# EAGLE design master (EAGLE 6.4)

## Sheet 1 of 2
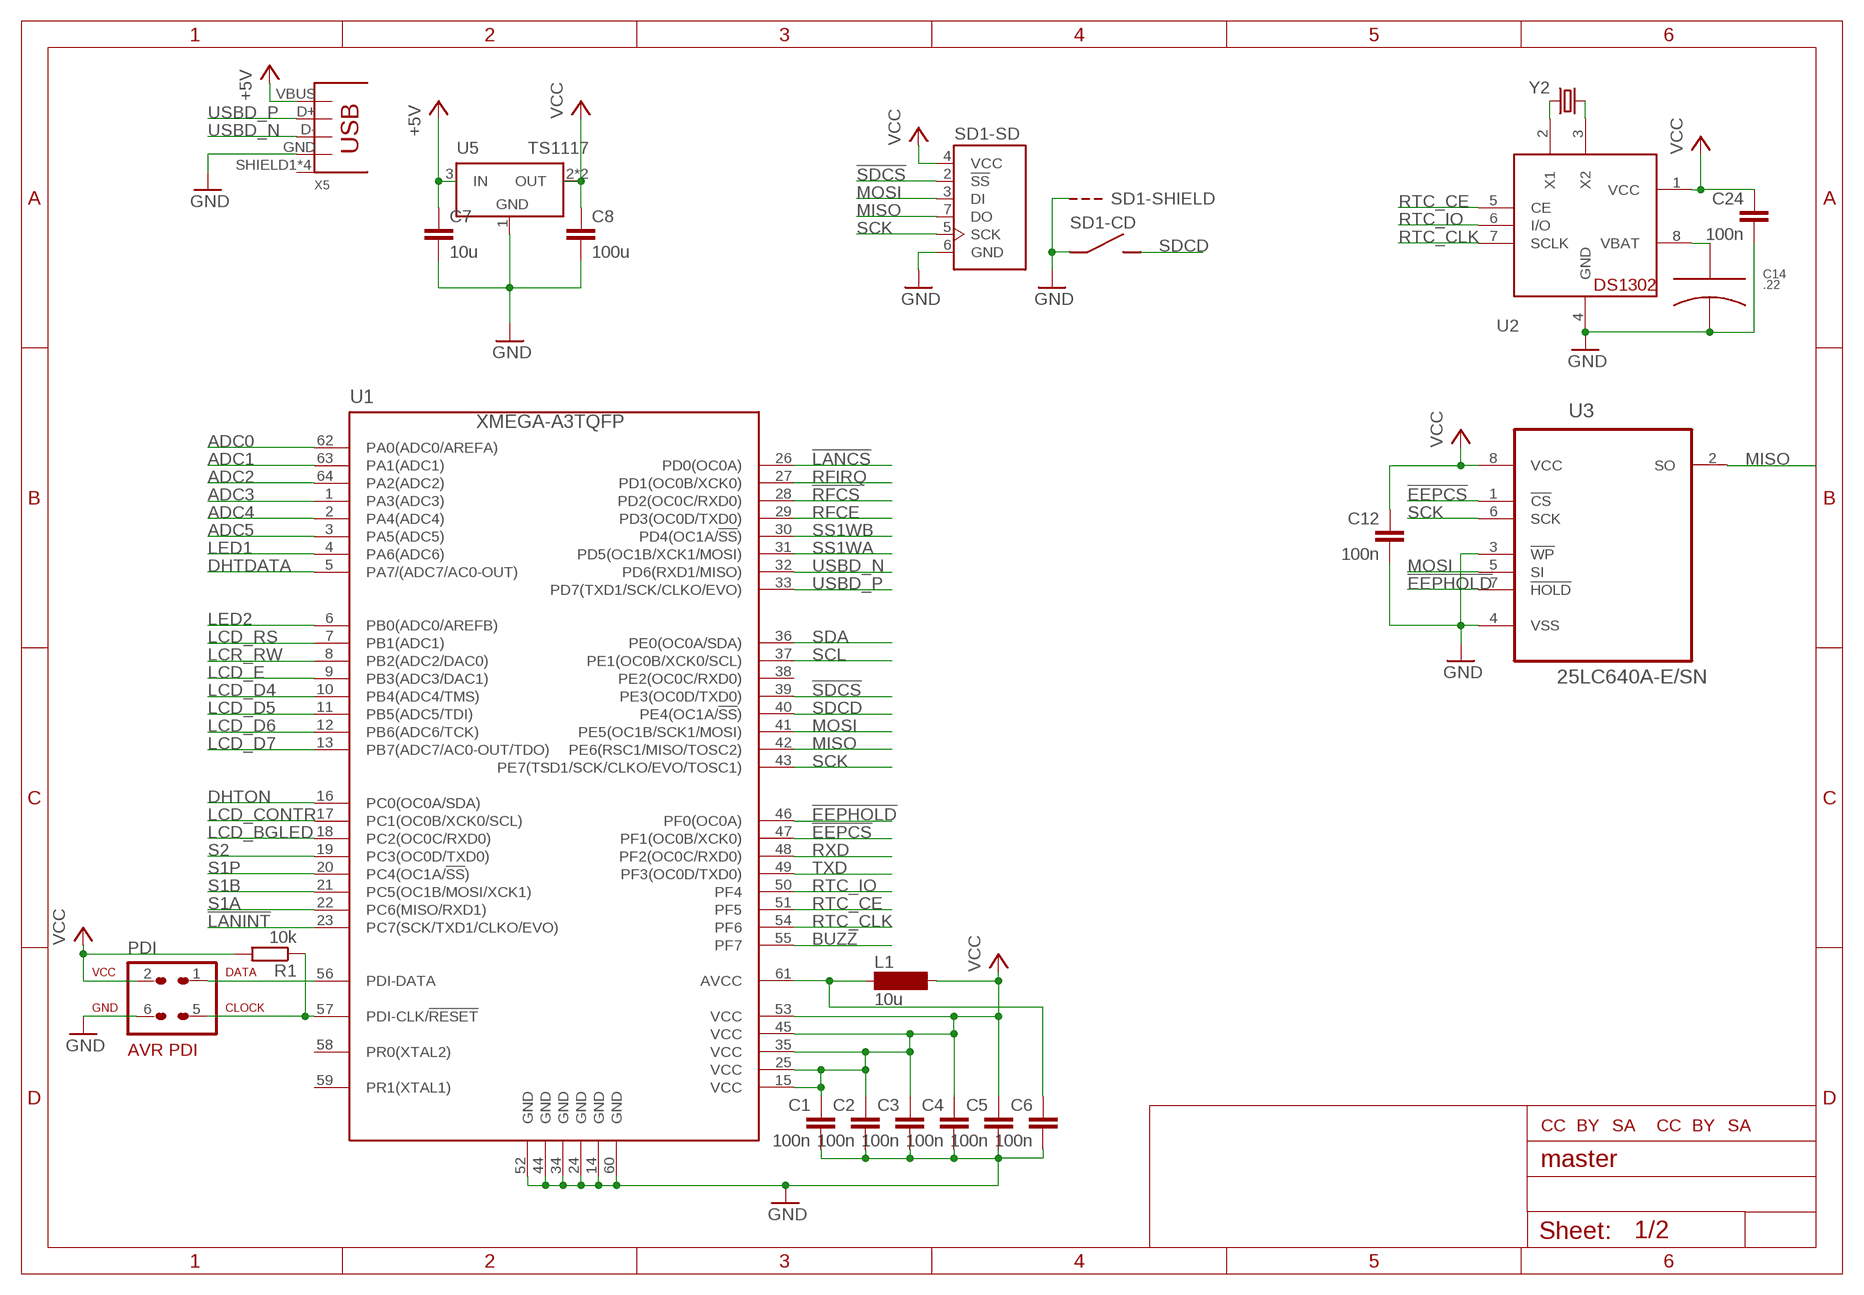
[diagram p0: schematic, sheet 1]

### Parts
C1  100n  C-EUC0603  [C0603]
C2  100n  C-EUC0603  [C0603]
C3  100n  C-EUC0603  [C0603]
C4  100n  C-EUC0603  [C0603]
C5  100n  C-EUC0603  [C0603]
C6  100n  C-EUC0603  [C0603]
C7  10u  C-EUC1206  [C1206]
C8  100u  C-EUC1210  [C1210]
C12  100n  C-EUC0603  [C0603]
C14  .22  SUPERCAP  [SUPERCAP]
C24  100n  C-EUC0603  [C0603]
L1  10u  SM-NE29  [SM-NE29]
PDI  AVR-PDIVERT  [AVR-ISP-6]
R1  10k  R-EU_R0603  [R0603]
SD1  MICROSD_SW  [MICROSD_SMD_EXTPIN]
U1  XMEGA-A3TQFP  [TQFP64]
U2  DS1302SOIC  [SOIC8_208MIL]
U3  25LC640A-E/SN  [SOIC127P600X175-8N]
U5  TS1117  [SOT223]
U$1  CC-TPLACE-HALF  [CC_TPLACE_HS]
U$2  BY-TPLACE-HS  [BY_TPLACE_HS]
U$7  SA-TPLACE-HALF  [SA_TPLACE_HS]
U$8  CC-TOP-HALF  [CC_TOP_HS]
U$9  BY-TOP-HALF  [BY_TOP_HS]
U$10  SA-TOP-HALF  [SA_TOP_HS]
X5  USB-MB-S  [USB-MB-S]
Y2  CRYSTALTC26H  [TC26H]

### Nets
!EEPCS: U1.47(PF1(OC0B/XCK0)) U3.1(!CS)
!EEPHOLD: U1.46(PF0(OC0A)) U3.7(!HOLD)
!LANCS: U1.26(PD0(OC0A)) ; also sheet 2
!LANINT: U1.23(PC7(SCK/TXD1/CLKO/EVO)) ; also sheet 2
!RFCS: U1.28(PD2(OC0C/RXD0)) ; also sheet 2
!SDCS: SD1.2(-SD:!SS) U1.39(PE3(OC0D/TXD0))
+5V [pwr]: C7.1 U5.3(IN) X5.VBUS ; also sheet 2
ADC0: U1.62(PA0(ADC0/AREFA)) ; also sheet 2
ADC1: U1.63(PA1(ADC1)) ; also sheet 2
ADC2: U1.64(PA2(ADC2)) ; also sheet 2
ADC3: U1.1(PA3(ADC3)) ; also sheet 2
ADC4: U1.2(PA4(ADC4)) ; also sheet 2
ADC5: U1.3(PA5(ADC5)) ; also sheet 2
BUZZ: U1.55(PF7) ; also sheet 2
DHTDATA: U1.5(PA7/(ADC7/AC0-OUT)) ; also sheet 2
DHTON: U1.16(PC0(OC0A/SDA)) ; also sheet 2
GND [pwr]: C1.2 C2.2 C3.2 C4.2 C5.2 C6.2 C7.2 C8.2 C12.2 C14.P$2 C24.2 PDI.6 SD1.6(-SD:GND) SD1.CD1(-CD:CD1) SD1.NC1(-SHIELD:SHIELD) SD1.NC2(-SHIELD:SHIELD) U1.14(GND) U1.24(GND) U1.34(GND) U1.44(GND) U1.52(GND) U1.60(GND) U2.4(GND) U3.3(!WP) U3.4(VSS) U5.1(GND) X5.GND ; also sheet 2
LCD_BGLED: U1.18(PC2(OC0C/RXD0)) ; also sheet 2
LCD_CONTR: U1.17(PC1(OC0B/XCK0/SCL)) ; also sheet 2
LCD_D4: U1.10(PB4(ADC4/TMS)) ; also sheet 2
LCD_D5: U1.11(PB5(ADC5/TDI)) ; also sheet 2
LCD_D6: U1.12(PB6(ADC6/TCK)) ; also sheet 2
LCD_D7: U1.13(PB7(ADC7/AC0-OUT/TDO)) ; also sheet 2
LCD_E: U1.9(PB3(ADC3/DAC1)) ; also sheet 2
LCD_RS: U1.7(PB1(ADC1)) ; also sheet 2
LCR_RW: U1.8(PB2(ADC2/DAC0)) ; also sheet 2
LED1: U1.4(PA6(ADC6)) ; also sheet 2
LED2: U1.6(PB0(ADC0/AREFB)) ; also sheet 2
MISO: SD1.7(-SD:DO) U1.42(PE6(RSC1/MISO/TOSC2)) U3.2(SO) ; also sheet 2
MOSI: SD1.3(-SD:DI) U1.41(PE5(OC1B/SCK1/MOSI)) U3.5(SI) ; also sheet 2
N$1: U2.2(X1) Y2.2
N$3: U2.3(X2) Y2.1
N$6: C14.P$1 U2.8(VBAT)
N$10: PDI.1 U1.56(PDI-DATA)
N$11: PDI.5 R1.1 U1.57(PDI-CLK/!RESET)
N$15: C6.1 L1.1 U1.61(AVCC)
RFCE: U1.29(PD3(OC0D/TXD0)) ; also sheet 2
RFIRQ: U1.27(PD1(OC0B/XCK0)) ; also sheet 2
RTC_CE: U1.51(PF5) U2.5(CE)
RTC_CLK: U1.54(PF6) U2.7(SCLK)
RTC_IO: U1.50(PF4) U2.6(I/O)
RXD: U1.48(PF2(OC0C/RXD0)) ; also sheet 2
S1A: U1.22(PC6(MISO/RXD1)) ; also sheet 2
S1B: U1.21(PC5(OC1B/MOSI/XCK1)) ; also sheet 2
S1P: U1.20(PC4(OC1A/!SS!)) ; also sheet 2
S2: U1.19(PC3(OC0D/TXD0)) ; also sheet 2
SCK: SD1.5(-SD:SCK) U1.43(PE7(TSD1/SCK/CLKO/EVO/TOSC1)) U3.6(SCK) ; also sheet 2
SCL: U1.37(PE1(OC0B/XCK0/SCL)) ; also sheet 2
SDA: U1.36(PE0(OC0A/SDA)) ; also sheet 2
SDCD: SD1.CD2(-CD:CD2) U1.40(PE4(OC1A/!SS!))
SS1WA: U1.31(PD5(OC1B/XCK1/MOSI)) ; also sheet 2
SS1WB: U1.30(PD4(OC1A/!SS!)) ; also sheet 2
TXD: U1.49(PF3(OC0D/TXD0)) ; also sheet 2
USBD_N: U1.32(PD6(RXD1/MISO)) X5.D-
USBD_P: U1.33(PD7(TXD1/SCK/CLKO/EVO)) X5.D+
VCC [pwr]: C1.1 C2.1 C3.1 C4.1 C5.1 C8.1 C12.1 C24.1 L1.2 PDI.2 R1.2 SD1.4(-SD:VCC) U1.15(VCC) U1.25(VCC) U1.35(VCC) U1.45(VCC) U1.53(VCC) U2.1(VCC) U3.8(VCC) U5.2(OUT) U5.4(OUT) ; also sheet 2
Unconnected: U1.38(PE2(OC0C/RXD0)) U1.58(PR0(XTAL2)) U1.59(PR1(XTAL1)) X5.SHIELD1(SHIELD) X5.SHIELD2(SHIELD) X5.SHIELD3(SHIELD) X5.SHIELD4(SHIELD)

## Sheet 2 of 2
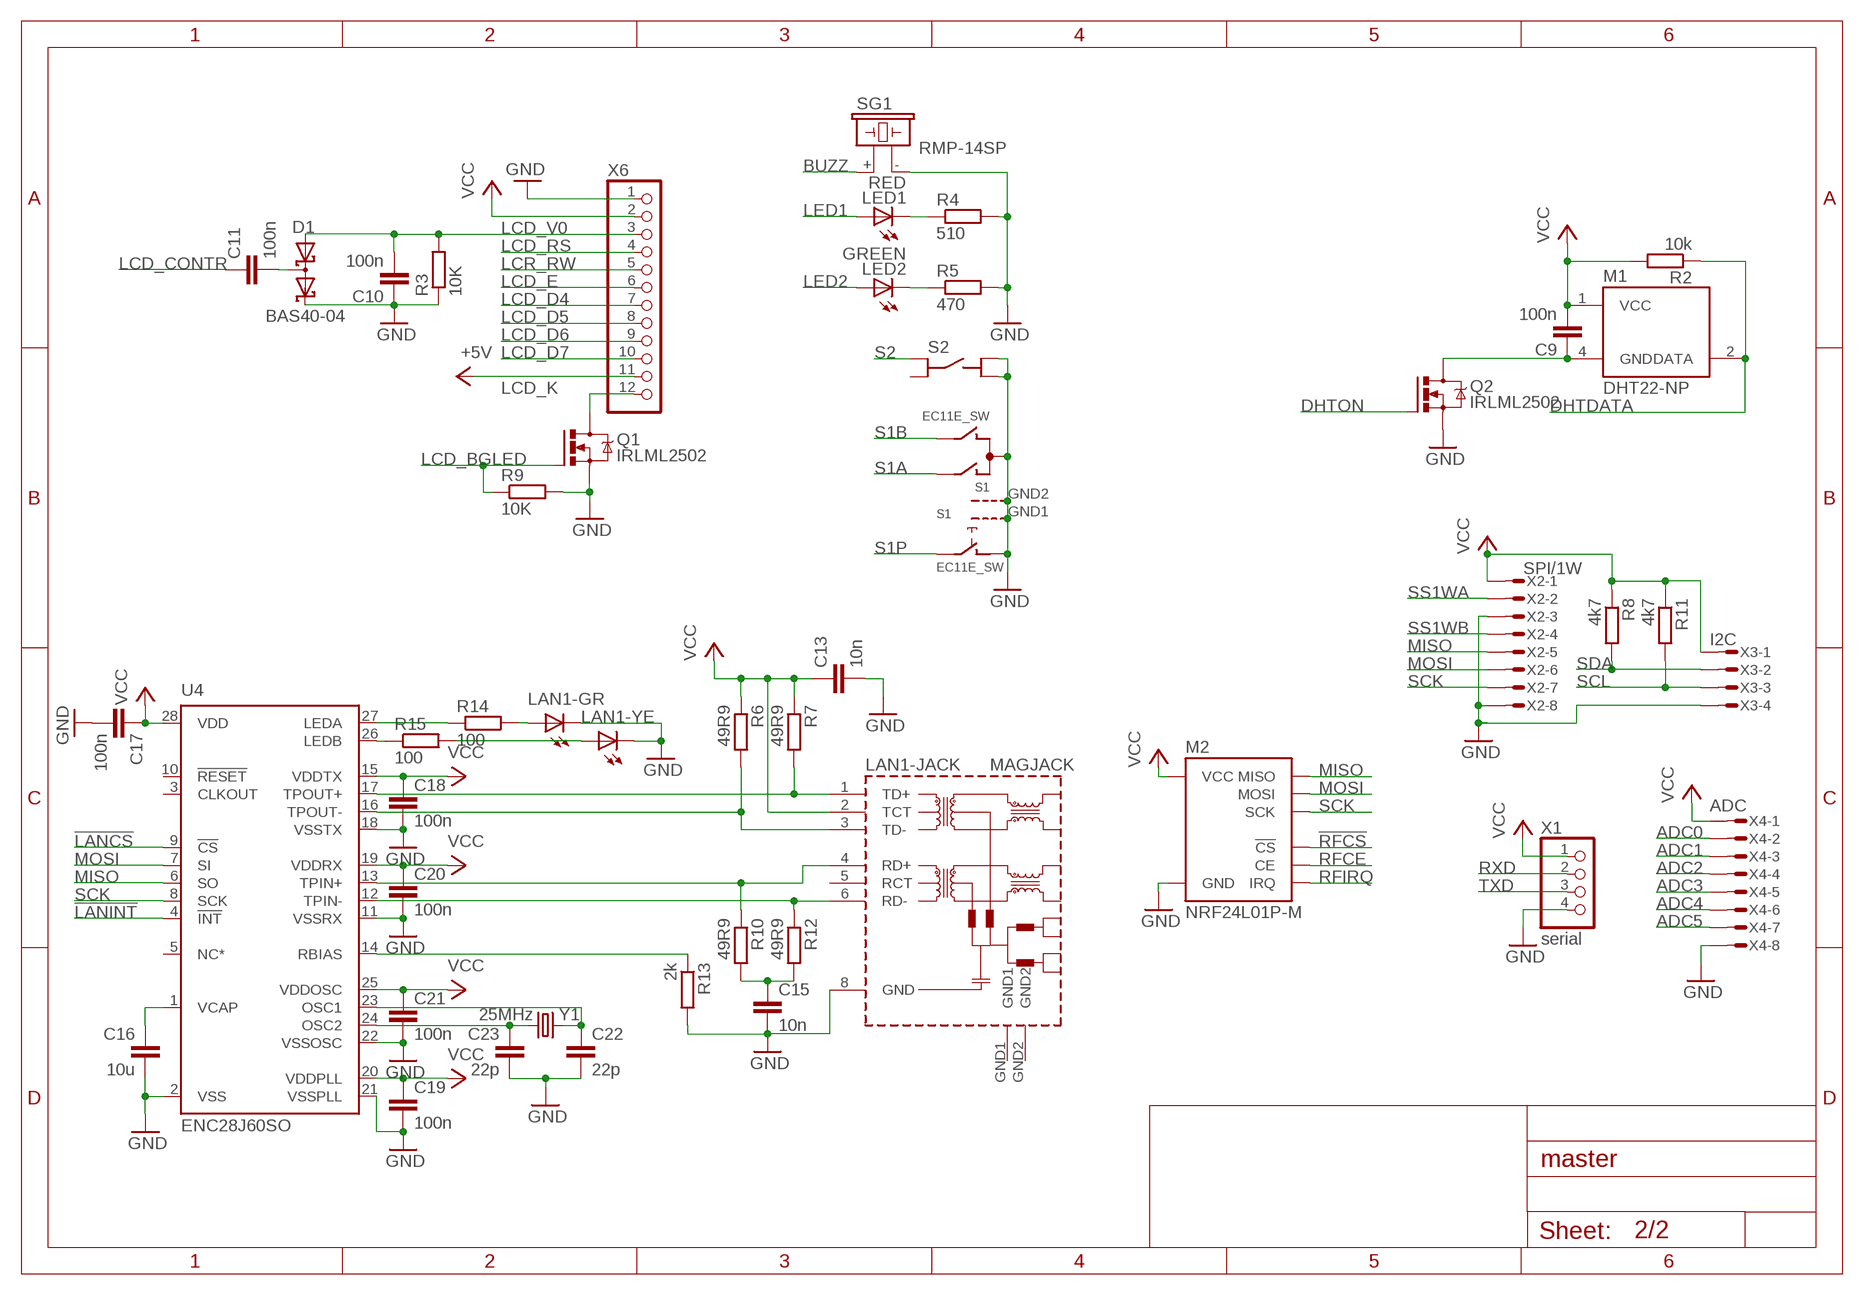
[diagram p1: schematic, sheet 2]

### Parts
C9  100n  C-EUC0603  [C0603]
C10  100n  C-EUC0603  [C0603]
C11  100n  C-EUC0603  [C0603]
C13  10n  C-EUC0603  [C0603]
C15  10n  C-EUC0603  [C0603]
C16  10u  C-EUC0603  [C0603]
C17  100n  C-EUC0603  [C0603]
C18  100n  C-EUC0603  [C0603]
C19  100n  C-EUC0603  [C0603]
C20  100n  C-EUC0603  [C0603]
C21  100n  C-EUC0603  [C0603]
C22  22p  C-EUC0603  [C0603]
C23  22p  C-EUC0603  [C0603]
D1  BAS40-04  [SOT23]
LAN1  MAGJACK  [MAGJACK]
LED1  RED  LED5MM  [LED5MM]
LED2  GREEN  LED5MM  [LED5MM]
M1  DHT22-NP  [DHT22-NOPRINT]
M2  NRF24L01P-M  [NRF24L01P-A]
Q1  IRLML2502  [MICRO3]
Q2  IRLML2502  [MICRO3]
R2  10k  R-EU_R0603  [R0603]
R3  10K  R-EU_R0603  [R0603]
R4  510  R-EU_R0603  [R0603]
R5  470  R-EU_R0603  [R0603]
R6  49R9  R-EU_R0603  [R0603]
R7  49R9  R-EU_R0603  [R0603]
R8  4k7  R-EU_R0603  [R0603]
R9  10K  R-EU_R0603  [R0603]
R10  49R9  R-EU_R0603  [R0603]
R11  4k7  R-EU_R0603  [R0603]
R12  49R9  R-EU_R0603  [R0603]
R13  2k  R-EU_R0603  [R0603]
R14  100  R-EU_R0603  [R0603]
R15  100  R-EU_R0603  [R0603]
S1  EC11E_SW  [ALPS_EC11E_SW]
S2  MEC-SWITCHSMT  [MEC-SMT]
SG1  RMP-14SP  F/CM12P  [F/CM12P]
U4  ENC28J60SO  [SO28W]
X1  serial  PINHD-1X4_2.54  [1X04]
X2  SPI/1W  MICROMATCH-8  [MICROMATCH-8]
X3  I2C  MICROMATCH-4  [MICROMATCH-4]
X4  ADC  MICROMATCH-8  [MICROMATCH-8]
X6  PINHD-1X12_2.54-R  [1X12R]
Y1  25MHz  CRYSTALHC49S  [HC49/S]

### Nets
!LANCS: U4.9(!CS) ; also sheet 1
!LANINT: U4.4(!INT) ; also sheet 1
!RFCS: M2.CSN(!CS) ; also sheet 1
+5V [pwr]: X6.11 ; also sheet 1
ADC0: X4.2 ; also sheet 1
ADC1: X4.3 ; also sheet 1
ADC2: X4.4 ; also sheet 1
ADC3: X4.5 ; also sheet 1
ADC4: X4.6 ; also sheet 1
ADC5: X4.7 ; also sheet 1
BUZZ: SG1.+ ; also sheet 1
DHTDATA: M1.2(DATA) R2.1 ; also sheet 1
DHTON: Q2.1(G) ; also sheet 1
GND [pwr]: C10.1 C13.2 C15.2 C16.2 C17.2 C18.2 C19.2 C20.2 C21.2 C22.2 C23.2 D1.2(C2) LAN1.8(-JACK:GND) LAN1.LED1.2(-YE:C) LAN1.LED2.2(-GR:C) M2.GND_A(GND) M2.GND_B(GND) Q1.2(S) Q2.2(S) R3.1 R4.2 R5.2 R9.2 R13.2 S1.C S1.D S1.GND1(G) S1.GND2(G) S2.3(B1) S2.4(B2) SG1.- U4.2(VSS) U4.11(VSSRX) U4.18(VSSTX) U4.21(VSSPLL) U4.22(VSSOSC) X1.4 X2.3 X2.8 X3.4 X4.8 X6.1 ; also sheet 1
LCD_BGLED: Q1.1(G) R9.1 ; also sheet 1
LCD_CONTR: C11.1 ; also sheet 1
LCD_D4: X6.7 ; also sheet 1
LCD_D5: X6.8 ; also sheet 1
LCD_D6: X6.9 ; also sheet 1
LCD_D7: X6.10 ; also sheet 1
LCD_E: X6.6 ; also sheet 1
LCD_K: Q1.3(D) X6.12
LCD_RS: X6.4 ; also sheet 1
LCD_V0: C10.2 D1.1(A1) R3.2 X6.3
LCR_RW: X6.5 ; also sheet 1
LED1: LED1.A ; also sheet 1
LED2: LED2.A ; also sheet 1
MISO: M2.MISO U4.6(SO) X2.5 ; also sheet 1
MOSI: M2.MOSI U4.7(SI) X2.6 ; also sheet 1
N$2: LED1.K(C) R4.1
N$4: C11.2 D1.3(C1A2)
N$5: LED2.K(C) R5.1
N$7: LAN1.4(-JACK:RD+) R10.1 U4.13(TPIN+)
N$8 [pwr]: C9.1 M1.4(GND) Q2.3(D)
N$12: LAN1.6(-JACK:RD-) R12.1 U4.12(TPIN-)
N$13: LAN1.3(-JACK:TD-) R6.2 U4.16(TPOUT-)
N$14: LAN1.1(-JACK:TD+) R7.2 U4.17(TPOUT+)
N$16: C15.1 R10.2 R12.2
N$17: R13.1 U4.14(RBIAS)
N$18: C23.1 U4.24(OSC2) Y1.1
N$19: C22.1 U4.23(OSC1) Y1.2
N$20: C16.1 U4.1(VCAP)
N$21: R14.1 U4.27(LEDA)
N$22: R15.1 U4.26(LEDB)
N$23: LAN1.LED2.1(-GR:A) R14.2
N$24: LAN1.LED1.1(-YE:A) R15.2
RFCE: M2.CE ; also sheet 1
RFIRQ: M2.IRQ ; also sheet 1
RXD: X1.2 ; also sheet 1
S1A: S1.A ; also sheet 1
S1B: S1.B ; also sheet 1
S1P: S1.E ; also sheet 1
S2: S2.1(A1) ; also sheet 1
SCK: M2.SCK U4.8(SCK) X2.7 ; also sheet 1
SCL: R11.2 X3.3 ; also sheet 1
SDA: R8.2 X3.2 ; also sheet 1
SS1WA: X2.2 ; also sheet 1
SS1WB: X2.4 ; also sheet 1
TXD: X1.3 ; also sheet 1
VCC [pwr]: C9.2 C13.1 C17.1 C18.1 C19.1 C20.1 C21.1 LAN1.2(-JACK:TCT) M1.1(VCC) M2.VCC_A(VCC) M2.VCC_B(VCC) R2.2 R6.1 R7.1 R8.1 R11.1 U4.15(VDDTX) U4.19(VDDRX) U4.20(VDDPLL) U4.25(VDDOSC) U4.28(VDD) X1.1 X2.1 X3.1 X4.1 X6.2 ; also sheet 1
Unconnected: LAN1.5(-JACK:RCT) LAN1.GND1(-JACK:GND1) LAN1.GND2(-JACK:GND2) S2.2(A2) U4.3(CLKOUT) U4.5(NC*) U4.10(!RESET)

## Library data of the parts
C1-C6 C9-C13 C15-C24 = rcl:C-EU: CAPACITOR, European symbol
C7 = rcl:C-EU: CAPACITOR, European symbol; _REICHELT_: X7R-G1206 10/16
C8 = rcl:C-EU: CAPACITOR, European symbol; _REICHELT_: X5R-G1210 100
C14 = carrilib:SUPERCAP: SuperCap, 5.5V .33F Manufacturer: Cornell Dubilier Part Number: EDLSD334V5R5C
D1 = diode:BAS40-04: Silicon Schottky Diodes General-purpose diode for high-speed switching
L1 = inductor-neosid:SM-NE29: INDUCTOR SMD chip inductor; OC_FARNELL: unknown; OC_NEWARK: unknown
LAN1 = magjack:MAGJACK: MagJack with slightly smaller than recommended, but better fitting pad-drills. SI-60024 SI-40138 SI-40139 SI-40140 SI-60062-F
LED1 = led:LED: LED OSRAM: - CHIPLED LG R971, LG N971, LY N971, LG Q971, LY Q971, LO R971, LY R971 LH N974, LH R974 LS Q976, LO Q976, LY Q976 LO Q996 - Hyper CHIPLED LW Q18S LB Q993, LB Q99A, LB R99A - SideLED LS A670, LO A670, LY A670, LG A670, LP A670 LB A673, LV A673, LT A673, LW A673 LH A674 LY A675 LS A676, LA A676, LO A676, LY A676, LW A676 LS A679, LY A679, LG A679 - Hyper Micro SIDELED® LS Y876, LA Y876, LO Y876, LY Y876 LT Y87S - SmartLED LW L88C, LW L88S LB L89C, LB L89S, LG L890 LS L89K, LO L89K, LY L89K LS L896, LA L896, LO L896, LY L896 - TOPLED LS T670, LO T670, LY T670, LG T670, LP T670 LSG T670, LSP T670, LSY T670, LOP T670, LYG T670 LG T671, LOG T671, LSG T671 LB T673, LV T673, LT T673, LW T673 LH T674 LS T676, LA T676, LO T676, LY T676, LB T676, LH T676, LSB T676, LW T676 LB T67C, LV T67C, LT T67C, LS T67K, LO T67K, LY T67K, LW E67C LS E67B, LA E67B, LO E67B, LY E67B, LB E67C, LV E67C, LT E67C LW T67C LS T679, LY T679, LG T679 LS T770, LO T770, LY T770, LG T770, LP T770 LB T773, LV T773, LT T773, LW T773 LH T774 LS E675, LA E675, LY E675, LS T675 LS T776, LA T776, LO T776, LY T776, LB T776 LHGB T686 LT T68C, LB T68C - Hyper Mini TOPLED® LB M676 - Mini TOPLED Santana® LG M470 LS M47K, LO M47K, LY M47K Source: http://www.osram.convergy.de LUXEON: - LUMILED® LXK2-PW12-R00, LXK2-PW12-S00, LXK2-PW14-U00, LXK2-PW14-V00 LXK2-PM12-R00, LXK2-PM12-S00, LXK2-PM14-U00 LXK2-PE12-Q00, LXK2-PE12-R00, LXK2-PE12-S00, LXK2-PE14-T00, LXK2-PE14-U00 LXK2-PB12-K00, LXK2-PB12-L00, LXK2-PB12-M00, LXK2-PB14-N00, LXK2-PB14-P00, LXK2-PB14-Q00 LXK2-PR12-L00, LXK2-PR12-M00, LXK2-PR14-Q00, LXK2-PR14-R00 LXK2-PD12-Q00, LXK2-PD12-R00, LXK2-PD12-S00 LXK2-PH12-R00, LXK2-PH12-S00 LXK2-PL12-P00, LXK2-PL12-Q00, LXK2-PL12-R00 Source: www.luxeon.com KINGBRIGHT: KA-3528ASYC Source: www.kingbright.com; I: 2mA; U_F: 2V
LED2 = led:LED: LED OSRAM: - CHIPLED LG R971, LG N971, LY N971, LG Q971, LY Q971, LO R971, LY R971 LH N974, LH R974 LS Q976, LO Q976, LY Q976 LO Q996 - Hyper CHIPLED LW Q18S LB Q993, LB Q99A, LB R99A - SideLED LS A670, LO A670, LY A670, LG A670, LP A670 LB A673, LV A673, LT A673, LW A673 LH A674 LY A675 LS A676, LA A676, LO A676, LY A676, LW A676 LS A679, LY A679, LG A679 - Hyper Micro SIDELED® LS Y876, LA Y876, LO Y876, LY Y876 LT Y87S - SmartLED LW L88C, LW L88S LB L89C, LB L89S, LG L890 LS L89K, LO L89K, LY L89K LS L896, LA L896, LO L896, LY L896 - TOPLED LS T670, LO T670, LY T670, LG T670, LP T670 LSG T670, LSP T670, LSY T670, LOP T670, LYG T670 LG T671, LOG T671, LSG T671 LB T673, LV T673, LT T673, LW T673 LH T674 LS T676, LA T676, LO T676, LY T676, LB T676, LH T676, LSB T676, LW T676 LB T67C, LV T67C, LT T67C, LS T67K, LO T67K, LY T67K, LW E67C LS E67B, LA E67B, LO E67B, LY E67B, LB E67C, LV E67C, LT E67C LW T67C LS T679, LY T679, LG T679 LS T770, LO T770, LY T770, LG T770, LP T770 LB T773, LV T773, LT T773, LW T773 LH T774 LS E675, LA E675, LY E675, LS T675 LS T776, LA T776, LO T776, LY T776, LB T776 LHGB T686 LT T68C, LB T68C - Hyper Mini TOPLED® LB M676 - Mini TOPLED Santana® LG M470 LS M47K, LO M47K, LY M47K Source: http://www.osram.convergy.de LUXEON: - LUMILED® LXK2-PW12-R00, LXK2-PW12-S00, LXK2-PW14-U00, LXK2-PW14-V00 LXK2-PM12-R00, LXK2-PM12-S00, LXK2-PM14-U00 LXK2-PE12-Q00, LXK2-PE12-R00, LXK2-PE12-S00, LXK2-PE14-T00, LXK2-PE14-U00 LXK2-PB12-K00, LXK2-PB12-L00, LXK2-PB12-M00, LXK2-PB14-N00, LXK2-PB14-P00, LXK2-PB14-Q00 LXK2-PR12-L00, LXK2-PR12-M00, LXK2-PR14-Q00, LXK2-PR14-R00 LXK2-PD12-Q00, LXK2-PD12-R00, LXK2-PD12-S00 LXK2-PH12-R00, LXK2-PH12-S00 LXK2-PL12-P00, LXK2-PL12-Q00, LXK2-PL12-R00 Source: www.luxeon.com KINGBRIGHT: KA-3528ASYC Source: www.kingbright.com; I: 2.2mA; U_F: 2V2
M1 = modules:DHT22
M2 = modules:NRF24L01P-M
PDI = avr-7:AVR-PDI: AVR PDI programming interface connector
Q1 Q2 = mosfet:IRLML2502: HEXFET N-Channel Power MOSFET http://www.irf.com/product-info/datasheets/data/irlml2502.pdf
R1-R15 = rcl:R-EU_: RESISTOR, European symbol
S1 = switch-alps:EC11E_SW: ALPS rotary Encoder EC12E series with switch
S2 = jt-switches:MEC-SWITCH: MEC switch
SD1 = sd:MICROSD_SW
SG1 = buzzer:F/CM12P: BUZZER Source: Buerklin; OC_FARNELL: unknown; OC_NEWARK: unknown
U1 = avr-7:XMEGA-A3: Atmel XMega A3 series processor
U2 = adafruit:DS1302: DS1302 - Real time clock with supercap trickle charger
U3 = microchip:25LC640A-E/SN: IC EEPROM 64KBIT 10MHZ,SOIC-8; MPN: 25LC640A-E/SN; OC_FARNELL: 2098000; OC_NEWARK: 27M1308; PACKAGE: SOIC-8; SUPPLIER: Microchip
U4 = microchip:ENC28J60: Stand-Alone Ethernet Controller with SPI Interface Source: http://ww1.microchip.com/downloads/en/DeviceDoc/39662c.pdf
U5 = TS1117:TS1117
U$1 U$8 = creative-commons:CC: creatice commons - CC
U$2 U$9 = creative-commons:BY: creative commons Attribution - BY
U$7 U$10 = creative-commons:SA: creative commons ShareAlike - SA
X1 = pinhead-mod:PINHD-1X4: PIN HEADER
X2 X4 = con-amp-micromatch:MICROMATCH-8: MicroMaTch 8 7-215464-8 / 0-215464-8 Drawing Number C-215464 DDEController.pdf
X3 = con-amp-micromatch:MICROMATCH-4: MicroMaTch 4 7-215464-4 / 0-215464-4 Drawing Number C-215464 DDEController.pdf
X5 = con-usb:USB: USB Connectors
X6 = pinhead-mod:PINHD-1X12: PIN HEADER
Y1 = crystal:CRYSTAL: CRYSTAL; OC_FARNELL: 1667008; OC_NEWARK: unknown
Y2 = crystal:CRYSTAL: CRYSTAL; OC_FARNELL: unknown; OC_NEWARK: unknown

## Net classes
1 pwr: width 0.254 mm

## Board
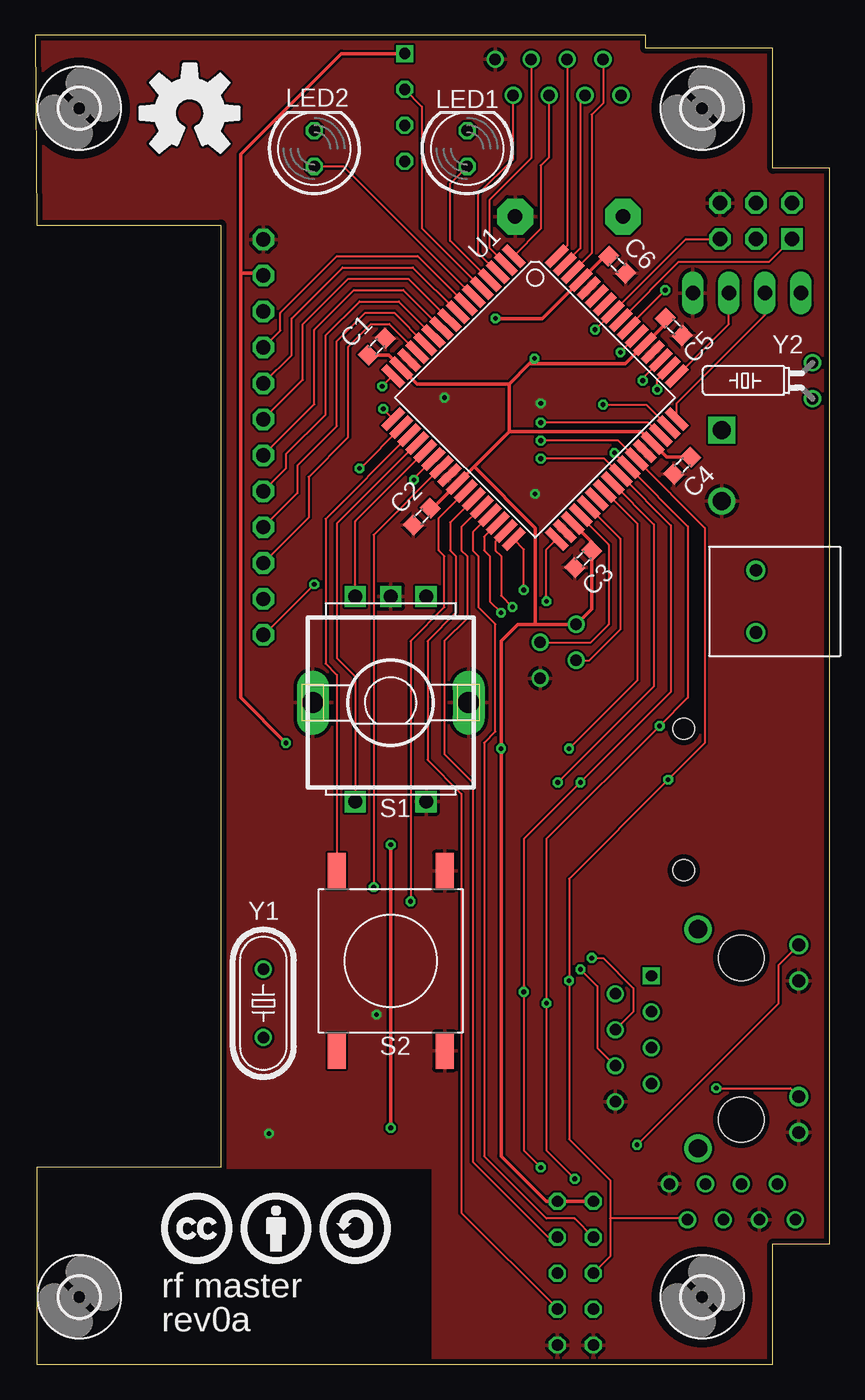
[diagram p2: board, top side]
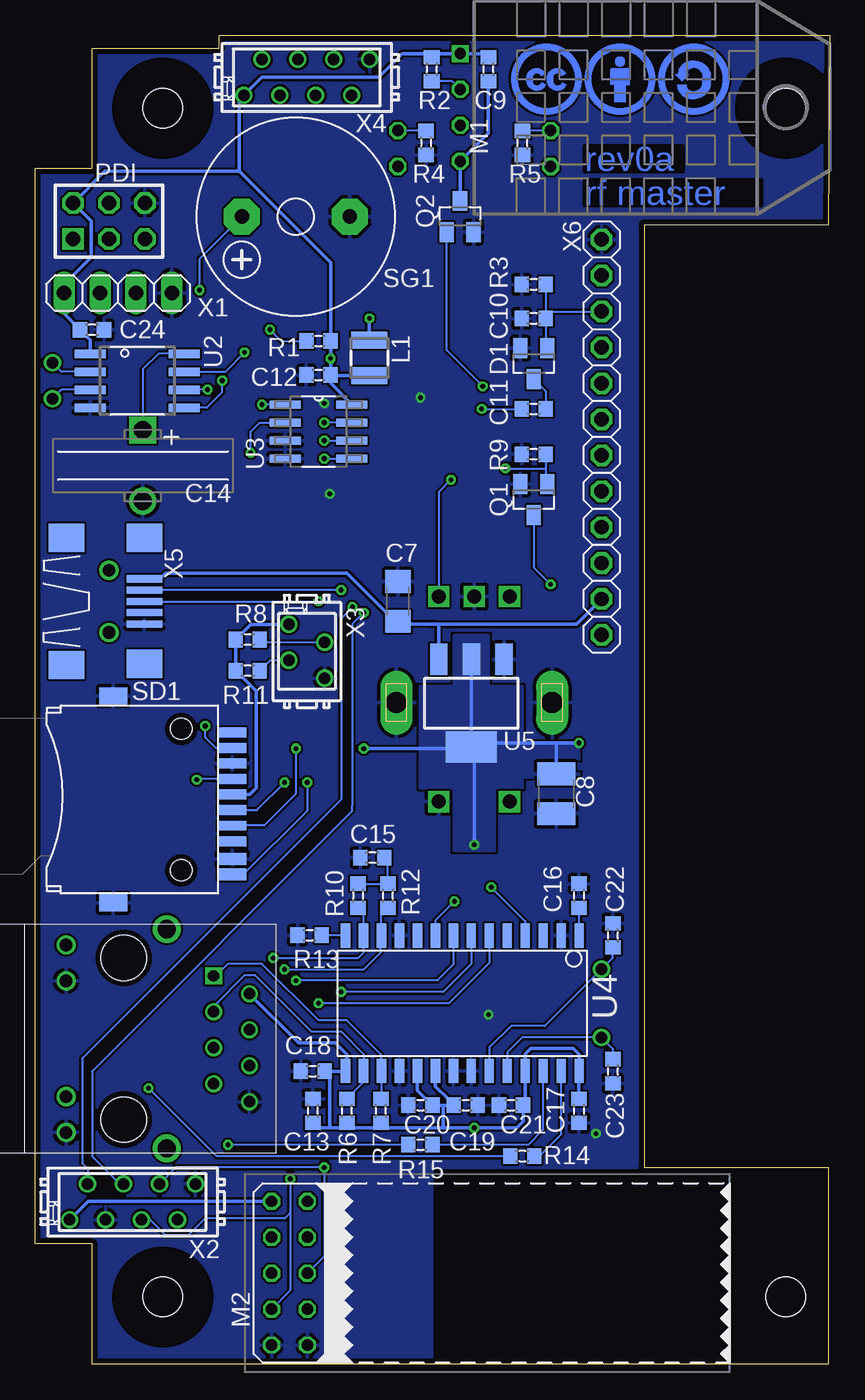
[diagram p3: board, bottom side, seen from below]

Size 56.1 x 93.9 mm. Coordinates in mm from the lower left corner, seen from the top.
Outline: 0.1,0 52.1,0 52.1,8.5 56.1,8.5 56.1,84.5 52.1,84.5 52.1,93 43.1,93 43.1,93.9 0,93.9 0.1,80.5 13.1,80.5 13.1,13.9 0.1,13.9 0.1,0
Copper layers (1*16): Top 0.0356mm / dielectric 1.5011mm / Bottom 0.0356mm
Design rules "oshpark": minimum track width 6mil, minimum drill 13mil, track to track 6mil, track to pad 6mil, pad to pad 6mil, via to via 6mil, smd to smd 6mil, copper to edge 15mil, drill to drill 6mil, minimum pad ring 7mil, minimum via ring 7mil, stop-mask expansion 4mil, vias tented up to drill 0mil, thermal gap 10mil

### Footprints (pad centres in the part's own frame; a part is rotated, then mirrored left to right if it is on the bottom)
C0603 = smd 1 x 1.1: 1 -0.85,0; 2 0.85,0
C1206 = smd 1.6 x 1.8: 1 -1.4,0; 2 1.4,0
C1210 = smd 1.6 x 2.7: 1 -1.4,0; 2 1.4,0
SUPERCAP = drill 1.27 square: P$1 -2.5,0 | drill 1.27: P$2 2.5,0
SOT23 = smd 1 x 1.4: 1 -0.95,-1.1; 2 0.95,-1.1; 3 0,1.1
SM-NE29 = smd 1.2 x 2.54: 1 -1.25,0; 2 1.25,0
MAGJACK = drill 0.8 square: 1 -4.445,6.35 | drill 0.8: 2 -3.175,8.89; 3 -1.905,6.35; 4 -0.635,8.89; 5 0.635,6.35; 6 1.905,8.89; 7 3.175,6.35; 8 4.445,8.89 | drill 1.3: GND1 -7.747,3.048; GND2 7.747,3.048 | drill 0.9: LED1.1 -6.629,-4.064; LED1.2 -4.089,-4.064; LED2.1 4.089,-4.064; LED2.2 6.629,-4.064 | hole 3.2: -5.715,0; 5.715,0
LED5MM = drill 0.813 octagon: A -1.27,0; K 1.27,0
DHT22-NOPRINT = drill 0.8 square: 1 -3.81,0 | drill 0.8 octagon: 2 -1.27,0; 3 1.27,0; 4 3.81,0
NRF24L01P-A = drill 0.8 octagon: CE -2.54,-1.27; CSN -2.54,1.27; GND_A 5.08,1.27; GND_B 5.08,-1.27; IRQ 2.54,1.27; MISO 2.54,-1.27; MOSI 0,1.27; SCK 0,-1.27; VCC_A -5.08,1.27; VCC_B -5.08,-1.27
AVR-ISP-6 = drill 1.016 square: 1 -2.54,-1.27 | drill 1.016 octagon: 2 -2.54,1.27; 3 0,-1.27; 4 0,1.27; 5 2.54,-1.27; 6 2.54,1.27
MICRO3 = smd 1 x 1.4: 1 -0.95,-1.1; 2 0.95,-1.1; 3 0,1.1
R0603 = smd 1 x 1.1: 1 -0.85,0; 2 0.85,0
ALPS_EC11E_SW = drill 1 square: A -2.5,-7.5; B 2.5,-7.5; C 0,-7.5; D -2.5,7; E 2.5,7 | drill 1.5 long: GND1 -5.5,0; GND2 5.5,0
MEC-SMT = smd 2.54 x 1.27: 1 6.35,3.81; 2 -6.35,3.81; 3 6.35,-3.81; 4 -6.35,-3.81
MICROSD_SMD_EXTPIN = smd 0.7 x 2: 1 2.95,13.1; 2 1.85,13.1; 3 0.75,13.1; 4 -0.35,13.1; 5 -1.45,13.1; 6 -2.55,13.1; 7 -3.65,13.1; 8 -4.75,13.1 | smd 0.85 x 2: CD1 4.2,13.1; CD2 5.3,13.1 | smd 1.2 x 2: NC1 7.3,4.7; NC2 -7.3,4.7 | hole 1.5: 5,9.5; -5,9.5
F/CM12P = drill 1.016 pad 2.54 octagon: + 3.81,0; - -3.81,0
TQFP64 = smd 1.85 x 0.55: 1 -8.15,6; 2 -8.15,5.2; 3 -8.15,4.4; 4 -8.15,3.6; 5 -8.15,2.8; 6 -8.15,2; 7 -8.15,1.2; 8 -8.15,0.4; 9 -8.15,-0.4; 10 -8.15,-1.2; 11 -8.15,-2; 12 -8.15,-2.8; 13 -8.15,-3.6; 14 -8.15,-4.4; 15 -8.15,-5.2; 16 -8.15,-6; 33 8.15,-6; 34 8.15,-5.2; 35 8.15,-4.4; 36 8.15,-3.6; 37 8.15,-2.8; 38 8.15,-2; 39 8.15,-1.2; 40 8.15,-0.4; 41 8.15,0.4; 42 8.15,1.2; 43 8.15,2; 44 8.15,2.8; 45 8.15,3.6; 46 8.15,4.4; 47 8.15,5.2; 48 8.15,6 | smd 0.55 x 1.85: 17 -6,-8.15; 18 -5.2,-8.15; 19 -4.4,-8.15; 20 -3.6,-8.15; 21 -2.8,-8.15; 22 -2,-8.15; 23 -1.2,-8.15; 24 -0.4,-8.15; 25 0.4,-8.15; 26 1.2,-8.15; 27 2,-8.15; 28 2.8,-8.15; 29 3.6,-8.15; 30 4.4,-8.15; 31 5.2,-8.15; 32 6,-8.15; 49 6,8.15; 50 5.2,8.15; 51 4.4,8.15; 52 3.6,8.15; 53 2.8,8.15; 54 2,8.15; 55 1.2,8.15; 56 0.4,8.15; 57 -0.4,8.15; 58 -1.2,8.15; 59 -2,8.15; 60 -2.8,8.15; 61 -3.6,8.15; 62 -4.4,8.15; 63 -5.2,8.15; 64 -6,8.15
SOIC8_208MIL = smd 0.6 x 2.2: 1 -1.905,-3.315; 2 -0.635,-3.315; 3 0.635,-3.315; 4 1.905,-3.315; 5 1.905,3.315; 6 0.635,3.315; 7 -0.635,3.315; 8 -1.905,3.315
SOIC127P600X175-8N = smd 2.184 x 0.559: 1 -2.362,1.905; 2 -2.362,0.635; 3 -2.362,-0.635; 4 -2.362,-1.905; 5 2.362,-1.905; 6 2.362,-0.635; 7 2.362,0.635; 8 2.362,1.905
SO28W = smd 0.65 x 1.7: 1 -7.62,-4.78; 2 -6.35,-4.78; 3 -5.08,-4.78; 4 -3.81,-4.78; 5 -2.54,-4.78; 6 -1.27,-4.78; 7 0,-4.78; 8 1.27,-4.78; 9 2.54,-4.78; 10 3.81,-4.78; 11 5.08,-4.78; 12 6.35,-4.78; 13 7.62,-4.78; 14 8.89,-4.78; 15 8.89,4.78; 16 7.62,4.78; 17 6.35,4.78; 18 5.08,4.78; 19 3.81,4.78; 20 2.54,4.78; 21 1.27,4.78; 22 0,4.78; 23 -1.27,4.78; 24 -2.54,4.78; 25 -3.81,4.78; 26 -5.08,4.78; 27 -6.35,4.78; 28 -7.62,4.78
SOT223 = smd 1.219 x 2.235: 1 -2.311,-3.099; 2 0,-3.099; 3 2.311,-3.099 | smd 3.6 x 2.2: 4 0,3.099
2,8 = hole 2.8: 0,0
1X04 = drill 1.016 long: 1 -3.81,0; 2 -1.27,0; 3 1.27,0; 4 3.81,0
MICROMATCH-8 = drill 0.813: 1 4.445,1.27; 2 3.175,-1.27; 3 1.905,1.27; 4 0.635,-1.27; 5 -0.635,1.27; 6 -1.905,-1.27; 7 -3.175,1.27; 8 -4.445,-1.27
MICROMATCH-4 = drill 0.813: 1 1.905,1.27; 2 0.635,-1.27; 3 -0.635,1.27; 4 -1.905,-1.27
USB-MB-S = smd 2.5 x 0.5: D+ 2.5,0; D- 2.5,0.8; GND 2.5,-1.6; ID 2.5,-0.8; VBUS 2.5,1.6 | drill 0.9: P$5 0,2.2; P$6 0,-2.2 | smd 2.5 x 2: SHIELD1 -3,4.5; SHIELD2 2.5,4.5; SHIELD3 -3,-4.5; SHIELD4 2.5,-4.4
1X12R = drill 1.016 octagon: 1 -13.97,0; 2 -11.43,0; 3 -8.89,0; 4 -6.35,0; 5 -3.81,0; 6 -1.27,0; 7 1.27,0; 8 3.81,0; 9 6.35,0; 10 8.89,0; 11 11.43,0; 12 13.97,0
HC49/S = drill 0.813: 1 -2.413,0; 2 2.413,0
TC26H = drill 0.813: 1 -1.27,0; 2 1.27,0

### Placement (x,y rotation side)
C1  24.1,71.9 45 top
C2  27.3,59.9 225 top
C3  38.7,56.9 225 top
C4  45.7,63.5 225 top
C5  45.1,73.3 315 top
C6  41.1,77.7 315 top
C7  30.5,53.9 90 bottom
C8  19.3,40.3 270 bottom
C9  24.1,91.5 90 bottom
C10  20.9,73.9 0 bottom
C11  20.9,67.5 0 bottom
C12  36.1,69.9 180 bottom
C13  36.5,17.9 90 bottom
C14  48.5,63.5 270 bottom
C15  32.3,35.8 180 bottom
C16  17.7,33.1 90 bottom
C17  17.7,17.9 270 bottom
C18  36.5,20.7 180 bottom
C19  25.7,18.3 0 bottom
C20  28.9,18.3 180 bottom
C21  22.5,18.3 180 bottom
C22  15.3,30.3 90 bottom
C23  15.3,20.7 270 bottom
C24  52.1,73.1 0 bottom
D1  20.9,70.7 180 bottom
L1  32.5,71.1 270 bottom
LAN1  49.87,23 270 bottom
LED1  30.5,85.9 90 top
LED2  19.7,85.9 90 top
M1  26.09,88.81 270 bottom
M2  38.15,6.43 270 bottom
PDI  50.9,80.78 0 bottom
Q1  20.9,61.1 180 bottom
Q2  26.1,81.1 0 bottom
R1  36.1,72.3 0 bottom
R2  28.1,91.5 90 bottom
R3  20.9,76.3 0 bottom
R4  28.5,86.3 270 bottom
R5  21.7,86.3 270 bottom
R6  34.1,17.9 90 bottom
R7  31.7,17.9 90 bottom
R8  41.1,51.2 0 bottom
R9  20.9,64.3 180 bottom
R10  33.3,33.1 90 bottom
R11  41.1,49.01 0 bottom
R12  31.2,33.1 90 bottom
R13  36.73,30.3 180 bottom
R14  21.7,14.7 180 bottom
R15  28.9,15.5 180 bottom
S1  25.1,46.75 180 top
S2  25.1,28.5 90 top
SD1  55.3,39.9 270 bottom
SG1  37.7,81.1 180 bottom
U1  35.3,68.3 315 top
U2  48.9,69.5 270 bottom
U3  36.1,65.9 0 bottom
U4  25.3,25.5 180 bottom
U5  25.3,46.7 180 bottom
U$1  8.9,7.1 0 top
U$2  14.5,7.1 0 top
U$3  [2,8]  3.1,88.75 0 top
U$4  [2,8]  47.1,88.75 0 top
U$5  [2,8]  3.1,4.75 0 top
U$6  [2,8]  47.1,4.75 0 top
U$7  20.1,7.1 0 top
U$8  22.5,88.3 0 bottom
U$9  17.3,88.3 0 bottom
U$10  12.1,88.3 0 bottom
X1  50.27,75.7 0 bottom
X2  49.23,11.47 180 bottom
X3  36.93,50.37 90 bottom
X4  36.93,90.94 180 bottom
X5  50.9,53.9 0 bottom
X6  16.1,65.5 270 bottom
Y1  16.1,25.5 90 top
Y2  54.9,69.5 90 top

### Tracks (layer width: path | path; a pad name or v marks a point on that pad's centre or on a via)
!EEPCS  (via drill 0.33)
  Top 0.152: v40.1,67.81 43.15,67.81 U1.47
  Bottom 0.152: U3.1 v40.1,67.81
!EEPHOLD  (via drill 0.33)
  Top 0.152: U1.46 43.29,66.53 v35.7,66.53
  Bottom 0.152: U3.7 v35.7,66.53
!LANCS  (via drill 0.33)
  Top 0.152: v26.5,32.7 26.5,51.1 28.9,53.5 28.9,57.1 28.5,57.5 28.5,59.8 U1.26
  Bottom 0.152: v26.5,32.7 27.84,31.36 U4.9
!LANINT  (via drill 0.33)
  Top 0.152: v23.9,33.7 23.9,58.6 U1.23
  Bottom 0.152: v23.9,33.7 21.49,31.29 U4.4
!RFCS
  Top 0.152: M2.CSN 36.23,8.97 30.9,14.3 30.9,41.1 28.9,43.1 28.9,51.1 30.5,52.7 30.5,57.1 30.1,57.5 30.1,59.14 U1.28
!SDCS  (via drill 0.33)
  Top 0.152: U1.39 42.5,59.4 42.5,48.3 v37.7,43.5
  Bottom 0.152: SD1.2 39.95,38.05 37.7,40.3 v37.7,43.5
+5V
  Bottom 0.254: X5.VBUS 47.3,55.5 46.9,55.9 34.1,55.9 30.5,52.3 30.3,52.3 | U5.3 27.61,52.21 27.7,52.3 | 27.7,52.3 28.1,52.3 30.3,52.3 | 30.3,52.3 C7.1 | 27.7,52.3 17.87,52.3 X6.11
ADC0
  Top 0.152: X4.2 40.11,89.11 39.3,88.3 39.3,78.52 U1.62
ADC1
  Top 0.152: X4.3 38.84,89.44 38.5,89.1 38.5,78.85 U1.63
ADC2
  Top 0.152: X4.4 37.57,79.05 U1.64
ADC3
  Top 0.152: 33.3,78.78 U1.1 35.7,80.23 35.7,84.7 36.3,85.3 X4.5
ADC4
  Top 0.152: X4.6 35.02,85.22 32.1,82.3 32.1,78.85 U1.2
ADC5
  Top 0.152: U1.3 31.3,78.52 31.3,82.7 33.76,85.16 X4.7
BUZZ  (via drill 0.33)
  Top 0.152: U1.55 41.91,73.31 v44.5,75.9
  Bottom 0.152: v44.5,75.9 44.5,78.11 SG1.+
DHTDATA
  Top 0.152: U1.5 27.3,80.26 27.3,88.87 M1.2
  Bottom 0.152: M1.2 26.66,90.65 R2.1
DHTON  (via drill 0.33)
  Top 0.152: U1.16 25.22,69.82 v24.5,69.1
  Bottom 0.152: v24.5,69.1 27.05,71.65 Q2.1
GND  (via drill 0.33)
  other vias: 16.5,16.3 24.1,24.7 28.9,68.3 35.7,67.9 35.3,61.5
  pour Bottom (rank 2): 13.3,13.9 13.3,80.3 -0.3,80.3 -0.3,94.3 56.5,94.3 56.5,-0.5 28.1,-0.5 28.1,13.9
  pour Top (rank 2): 13.3,94.7 56.9,94.7 56.9,-0.9 28.1,-0.9 28.1,13.9 13.3,13.9 13.3,80.3 -0.3,80.3 -0.3,94.7
LCD_BGLED  (via drill 0.33)
  Top 0.152: U1.18 22.95,63.3 v22.9,63.3
  Bottom 0.152: R9.1 20.05,63.3 | 20.05,63.3 20.05,62.3 Q1.1 | v22.9,63.3 20.05,63.3
LCD_CONTR  (via drill 0.33)
  Top 0.152: U1.17 v24.57,67.5
  Bottom 0.152: v24.57,67.5 C11.1
LCD_D4
  Top 0.152: U1.10 26,75.9 22.5,75.9 19.7,73.1 19.7,67.83 X6.7
LCD_D5
  Top 0.152: U1.11 25.67,75.1 22.9,75.1 20.5,72.7 20.5,67.1 17.7,64.3 17.7,63.29 X6.8
LCD_D6
  Top 0.152: U1.12 25.34,74.3 23.3,74.3 21.3,72.3 21.3,66.3 18.5,63.5 18.5,61.55 X6.9
LCD_D7
  Top 0.152: U1.13 25.01,73.5 23.7,73.5 22.1,71.9 22.1,65.5 19.3,62.7 19.3,59.81 X6.10
LCD_E
  Top 0.152: U1.9 26.33,76.7 22.1,76.7 18.9,73.5 18.9,69.57 X6.6
LCD_K  (via drill 0.33)
  Top 0.152: v19.7,55.1 16.13,51.53 X6.12
  Bottom 0.152: Q1.3 20.9,56.3 v19.7,55.1
LCD_RS
  Top 0.152: U1.7 27,78.3 21.3,78.3 17.3,74.3 17.3,73.05 X6.4
LCD_V0
  Bottom 0.152: X6.3 20.05,74.39 C10.2 | R3.2 C10.2 | C10.2 20.05,71.8 D1.1
LCR_RW
  Top 0.152: U1.8 26.67,77.5 21.7,77.5 18.1,73.9 18.1,71.31 X6.5
LED1
  Top 0.152: U1.4 29.3,79.39 29.3,83.43 LED1.A
LED2
  Top 0.152: U1.6 30.92,75.48 21.77,84.63 LED2.A
MISO  (via drill 0.33)
  Top 0.152: v38.1,13.1 36.1,15.1 v36.1,25.5 36.1,37.1 v44.1,45.1 46.1,47.1 46.1,59.2 U1.42 v40.9,64.4
  Bottom 0.152: U4.6 24.03,28.37 26.9,25.5 v36.1,25.5 | v38.1,13.1 38.1,10.7 | 38.1,10.7 38.1,5.21 M2.MISO | 38.1,10.7 38.5,10.3 44.1,10.3 45.3,9.1 46.9,9.1 48,10.2 X2.5 | v40.9,64.4 40.9,65.9 40.27,66.53 U3.2 | SD1.7 43.35,43.55 44.1,44.3 v44.1,45.1
MOSI  (via drill 0.33)
  Top 0.152: v35.7,13.9 34.5,15.1 v34.5,26.3 34.5,37.1 v38.5,41.1 44.9,47.5 44.9,59.27 U1.41 40.17,64 v35.7,64
  Bottom 0.152: U4.7 25.3,28.3 27.3,26.3 v34.5,26.3 | M2.MOSI 35.7,7.61 v35.7,13.9 46.17,13.9 X2.6 | v35.7,64 U3.5 | SD1.3 40.45,39.15 v38.5,41.1
N$1
  Bottom 0.152: U2.2 54.27,70.14 Y2.2
N$2
  Bottom 0.152: R4.1 28.52,87.17 LED1.K
N$3
  Bottom 0.152: U2.3 54.27,68.86 Y2.1
N$4
  Bottom 0.152: D1.3 20.05,68.75 C11.2
N$5
  Bottom 0.152: LED2.K 21.68,87.17 R5.1
N$6
  Bottom 0.152: U2.8 47.4,71.41 48.5,70.3 C14.P$1
N$7  (via drill 0.33)
  Top 0.152: LAN1.4 42.25,24.9 42.25,26.55 40.1,28.7 v39.3,28.7
  Bottom 0.152: R10.1 32.92,31.87 U4.13 32.9,30.26 32.9,29.1 33.3,28.7 v39.3,28.7
N$8
  Bottom 0.254: Q2.3 M1.4 24.1,86.99 C9.1
N$10
  Top 0.152: U1.56 45.47,77.9 51.83,77.9 PDI.1
N$11  (via drill 0.33)
  Top 0.152: v39.53,73.1 U1.57 45.94,79.51 PDI.5
  Bottom 0.152: v39.53,73.1 38.73,72.3 R1.1
N$12  (via drill 0.33)
  Top 0.152: LAN1.6 39.7,22.36 39.7,26.7 v38.51,27.9
  Bottom 0.152: R12.1 31.65,31.8 U4.12 31.7,30.23 31.7,29.1 32.9,27.9 v38.51,27.9
N$13
  Bottom 0.152: LAN1.3 43.52,25.29 41.3,27.5 40.6,27.5 36.6,23.5 34.5,23.5 32.9,21.9 32.9,20.74 U4.16 32.92,19.93 R6.2
N$14
  Bottom 0.152: LAN1.1 43.36,27.44 42.5,28.3 40.1,28.3 36.1,24.3 34.1,24.3 31.7,21.9 31.7,20.77 U4.17 31.65,18.8 R7.2
N$15  (via drill 0.33)
  Top 0.254: C6.1 40.21,78.3 U1.61 35.81,73.9 v32.5,73.9
  Bottom 0.254: L1.1 v32.5,73.9
N$16
  Bottom 0.152: R10.2 R12.2 31.2,35.55 C15.1
N$17
  Bottom 0.152: U4.14 34.21,30.3 R13.1
N$18
  Bottom 0.152: U4.24 22.76,22.04 21.71,23.09 Y1.1 15.3,22.29 C23.1
N$19
  Bottom 0.152: U4.23 24.03,22.37 22.5,23.9 20.11,23.9 Y1.2 15.3,28.71 C22.1
N$20
  Bottom 0.152: U4.1 17.68,32.33
  Bottom 0.254: 17.68,32.33 17.7,32.31 C16.1
N$21
  Bottom 0.152: U4.27 18.95,16.25 20.5,14.7 R14.1
N$22
  Bottom 0.152: U4.26 20.22,16.58 21.3,15.5 R15.1
N$23  (via drill 0.33)
  Top 0.152: v48.1,19.5 53.34,19.5 LAN1.LED2.1
  Bottom 0.152: R14.2 43.3,14.7 v48.1,19.5
N$24  (via drill 0.33)
  Top 0.152: v42.5,15.5 52.5,25.5 52.5,28.2 LAN1.LED1.1
  Bottom 0.152: R15.2 v42.5,15.5
N$28
  Top 0.25: 11.82,86.18 arc10 12.17,86.36 13.05,85.64 13.65,86.25 12.94,87.12 arc19 13.24,87.86 14.37,87.97 14.37,88.83 13.24,88.94 arc19 12.94,89.67 13.65,90.56 13.05,91.16 12.17,90.44 arc19 11.44,90.75 11.32,91.87 10.47,91.87 10.35,90.75 arc19 9.62,90.44 8.74,91.16 8.14,90.56 8.85,89.67 arc19 8.55,88.94 7.42,88.83 7.42,87.97 8.55,87.86 arc19 8.85,87.12 8.14,86.25 8.74,85.64 9.62,86.36 arc10 9.97,86.18 10.48,87.39 arc-68 9.8,88.4 arc-248 11.31,87.39 11.82,86.18
RFCE
  Top 0.152: M2.CE 38.09,10.29 36.11,10.29 31.7,14.7 31.7,43.9 32.5,44.7 32.5,52.3 31.3,53.5 31.3,57.1 30.9,57.5 30.9,58.81 U1.29
RFIRQ
  Top 0.152: M2.IRQ 36.9,3.9 30.1,10.7 30.1,40.3 27.7,42.7 27.7,51.1 29.7,53.1 29.7,57.1 29.3,57.5 29.3,59.47 U1.27
RTC_CE  (via drill 0.33)
  Top 0.152: U1.51 42.9,69.68 v42.9,69.5
  Bottom 0.152: v42.9,69.5 42.9,68.7 44.01,67.59 U2.5
RTC_CLK  (via drill 0.33)
  Top 0.152: U1.54 v41.33,71.5
  Bottom 0.152: U2.7 42.66,70.14 41.33,71.47 v41.33,71.5
RTC_IO  (via drill 0.33)
  Top 0.152: v43.94,68.86 43.94,69.58 U1.50
  Bottom 0.152: v43.94,68.86 U2.6
RXD
  Top 0.152: U1.48 45.31,67.91 51.54,74.14 X1.2
S1A  (via drill 0.33)
  Top 0.152: v26.74,62.5 26.74,62.57 U1.22
  Bottom 0.152: S1.A 27.6,61.64 v26.74,62.5
S1B
  Top 0.152: S1.B 22.6,59.56 U1.21
S1P
  Top 0.152: S1.E 22.6,48.6 21.3,49.9 21.3,59.39 U1.20
S2
  Top 0.152: 21.1,35.04 S2.1 21.3,35.5 20.9,35.9 21.3,35.9 21.3,48.7 20.5,49.5 20.5,59.72 U1.19
SCK  (via drill 0.33)
  Top 0.152: 40.61,10.3 40.61,12.99 37.7,15.9 v37.7,27.1 37.7,34.3 v44.7,41.3 47.3,43.9 47.3,59.1 42.48,63.92 U1.43 41.16,65.27 v35.7,65.27 | 40.61,10.3 40.61,7.62 M2.SCK | X2.7 45.96,10.3 40.61,10.3
  Bottom 0.152: U4.8 26.57,28.23 27.7,27.1 v37.7,27.1 | v35.7,65.27 U3.6 | SD1.5 44.65,41.35 v44.7,41.3
SCL
  Top 0.152: X3.3 39.13,49.73 41.3,51.9 41.3,58.34 U1.37
  Bottom 0.152: X3.3 39.52,49.73 R11.2
SDA
  Top 0.152: U1.36 38.52,59.88 40.5,57.9 40.5,52.27 39.23,51.01 X3.2
  Bottom 0.152: X3.2 40.05,51.01 R8.2
SDCD  (via drill 0.33)
  Top 0.152: U1.40 43.7,59.33 43.7,47.9 v36.9,41.1
  Bottom 0.152: 41.7,34.6 41.4,34.6 36.9,39.1 v36.9,41.1 | 41.6,34.7 41.7,34.6 | 41.7,34.6 SD1.CD2
SS1WA  (via drill 0.33)
  Top 0.152: U1.31 32.5,58.15 32.5,57.5 32.9,57.1 32.9,54.3 v33.7,53.5
  Bottom 0.152: v33.7,53.5 34.5,52.7 34.5,39.9 52.8,21.6 52.8,14.2 52.41,13.81 X2.2
SS1WB  (via drill 0.33)
  Top 0.152: U1.30 31.7,58.48 31.7,57.5 32.1,57.1 32.1,53.9 v32.9,53.1
  Bottom 0.152: v32.9,53.1 33.7,52.3 33.7,39.9 33.7,39.5 33.7,39.1 52.1,20.7 52.1,14.7 50.14,12.74 X2.4
TXD
  Top 0.152: U1.49 49,73.51 X1.3
USBD_N  (via drill 0.33)
  Top 0.152: 33.3,57.9 33.38,57.9 U1.32 34.5,57.57 v34.5,54.7
  Bottom 0.152: v34.5,54.7 X5.D-
USBD_P  (via drill 0.33)
  Top 0.152: v36.1,53.9 36.1,57.57 U1.33
  Bottom 0.152: X5.D+ v36.1,53.9
VCC  (via drill 0.33)
  Top 0.254: v17.7,43.9 14.5,47.1 14.5,77.1 | 14.5,77.1 14.5,85.5 21.62,92.62 M1.1 | M2.VCC_B M2.VCC_A 36.11,11.51 36.1,11.5 32.9,14.7 v32.9,43.5 32.9,51.1 34.08,52.27 35.3,52.27 | 46.1,64.3 C4.1 44.59,64.1 U1.45 42.79,65.9 33.47,65.9 | C5.1 44.5,73.5 43.08,72.08 U1.53 41.66,70.7 35.25,70.7 | U1.35 39.3,58.08 C3.1 | 39.7,57.5 C3.1 | 30.99,63.42 U1.25 28.07,60.5 C2.1 | 30.99,63.42 33.47,65.9 | 34.9,70.7 35.25,70.7 | 33.47,65.9 33.47,69.27 | 33.47,69.27 26.98,69.27 U1.15 24.95,71.3 C1.1 | X6.2 15.93,77.1 14.5,77.1 | v25.1,16.7 v25.1,36.7 | 33.47,69.27 34.9,70.7 | 35.25,70.7 v35.25,71.06 v35.25,71.05 34.9,70.7 | 35.3,52.27 35.3,59.1 30.99,63.41 30.99,63.42 | 35.3,52.27 X3.1 39.3,53.38 C3.1
  Bottom 0.254: R2.2 27.83,92.62 M1.1 | X3.1 40.88,52.27 R8.1 R11.1 40.5,47.55 40.5,40.7 40.95,40.25 SD1.4 | C9.2 24.37,92.62 M1.1 | C17.1 17.7,20.7 U4.28 17.68,21.88 18.1,22.3 21.1,22.3 21.49,21.91 U4.25 21.49,18.46 C21.1 21.65,17.15 22.1,16.7 v25.1,16.7 27.3,16.7 | 31.55,17.2 R7.1 | U4.20 27.84,19.64 26.9,18.7 26.9,18.65 C19.1 27.3,18.3 | U4.19 29.11,19.36 C20.1 27.3,18.3 | 27.3,16.7 31.35,16.7 R7.1 | 27.3,16.7 27.3,18.3 | R7.1 32.05,16.7 33.7,16.7 34.05,17.05 R6.1 34.45,16.7 35.3,16.7 | 35.3,16.7 36.1,16.7 36.45,17.05 C13.1 | 35.3,16.7 35.32,16.72 35.32,20.37 C18.1 34.21,20.7 U4.15 34.1,20.81 34.1,21.9 34.9,22.7 37.51,22.7 LAN1.2 | X4.1 40.11,90.94 31.85,90.94 30.17,92.62 M1.1 | 41.62,89.43 X4.1 | 41.7,84.3 51.19,84.3 PDI.2 52.17,80.78 52.17,78.24 54.08,76.33 X1.1 54.08,74.22 C24.1 52.22,72.36 U2.1 | 41.7,84.3 35.25,77.85 R1.2 v35.25,71.06 C12.1 | 25.3,43.9 19.3,43.9 | 19.3,43.9 v17.7,43.9 | v25.1,36.7 25.1,43.4 U5.4 | U5.4 25.3,43.9 | 25.1,43.7 25.3,43.9 | v32.9,43.5 25.3,43.5 U5.4 | M2.VCC_B 52.37,11.51 X2.1 | 41.7,84.3 41.7,89.34 X4.1 | U5.4 U5.2 | C8.1 19.3,43.9 | C12.1 35.2,69.95 | U3.8 35.25,69.32 C12.1 | L1.2 35.25,69.85 C12.1
  pour Bottom (no thermals): 24.1,47.9 21.7,47.9 21.7,40.7 23.7,40.7 23.7,36.3 26.5,36.3 26.5,40.7 28.9,40.7 28.9,47.9 26.5,47.9 26.5,51.5 24.1,51.5
  pour Bottom: 21.7,41.5 17.7,41.5 17.7,43.9 21.7,43.9